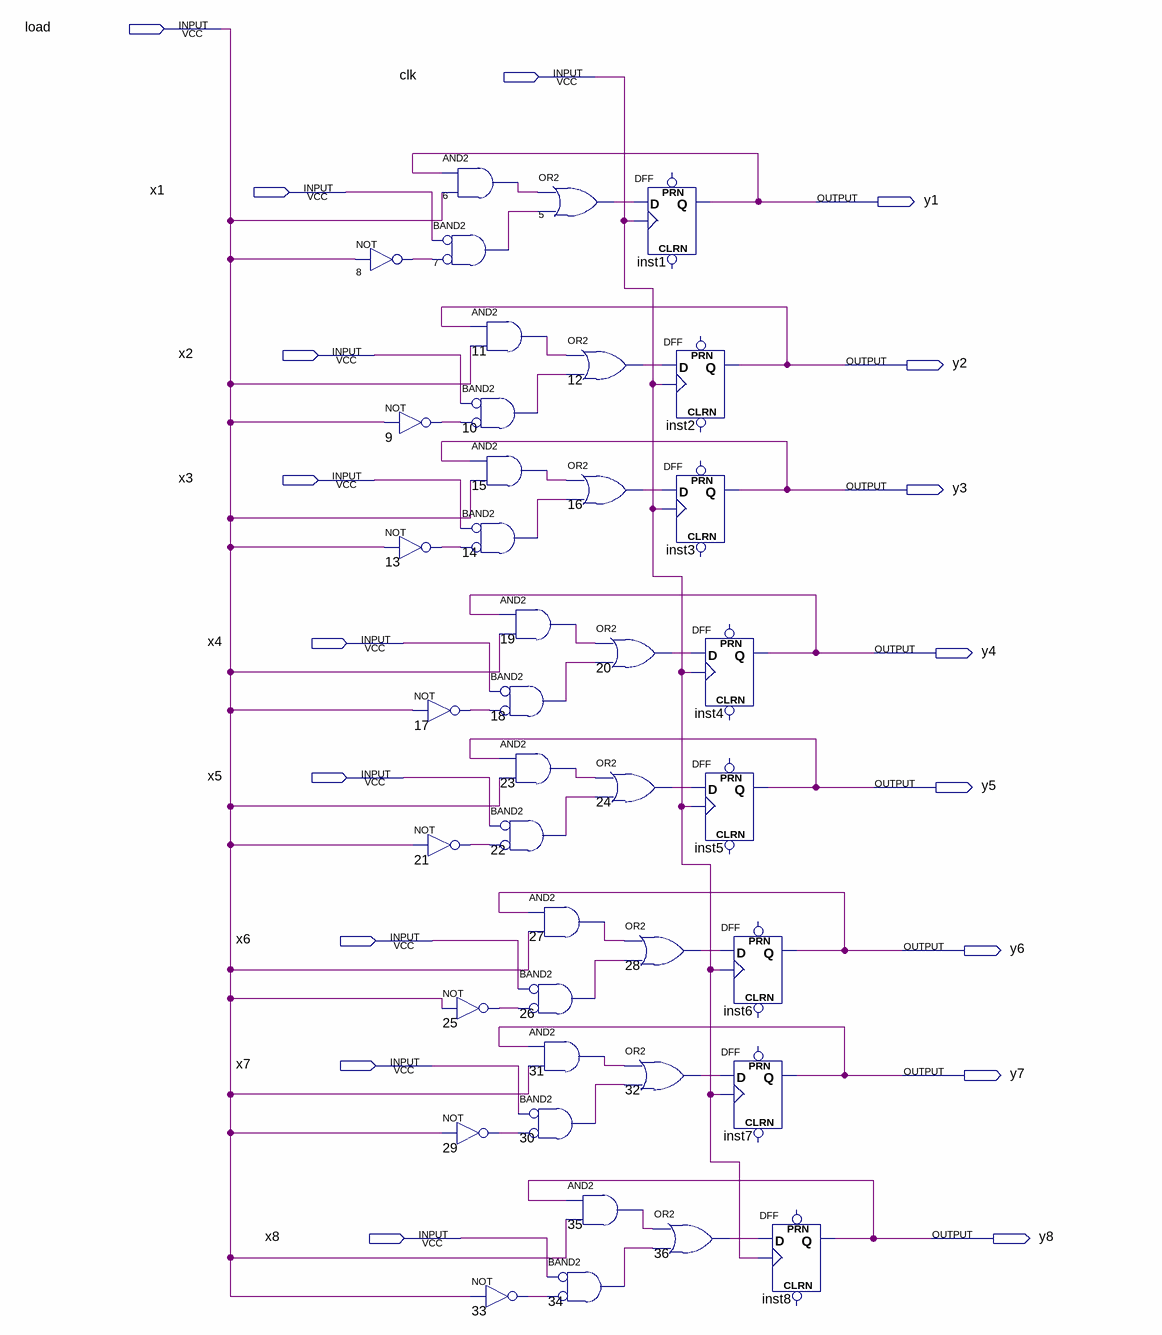
[diagram p0: schematic sheet]
// Quartus schematic lab03.bdf as structural Verilog: 40 symbols, 18 pins
module lab03 (
  input  load,
  input  clk,
  input  x1,
  input  x2,
  input  x3,
  input  x4,
  input  x5,
  input  x6,
  input  x7,
  input  x8,
  output y1,
  output y2,
  output y3,
  output y4,
  output y5,
  output y6,
  output y7,
  output y8
);

  wire n5_out, n6_out, n7_out, n8_out, n9_out, n10_out, n11_out, n12_out, n13_out, n14_out, n15_out, n16_out,
       n17_out, n18_out, n19_out, n20_out, n21_out, n22_out, n23_out, n24_out, n25_out, n26_out, n27_out,
       n28_out, n29_out, n30_out, n31_out, n32_out, n33_out, n34_out, n35_out, n36_out;

  not u_8 (n8_out, load);
  and u_6 (n6_out, y1, load);
  and u_7 (n7_out, ~x1, ~n8_out);  // BAND2
  not u_9 (n9_out, load);
  not u_13 (n13_out, load);
  not u_17 (n17_out, load);
  not u_21 (n21_out, load);
  not u_25 (n25_out, load);
  not u_29 (n29_out, load);
  and u_11 (n11_out, y2, load);
  and u_10 (n10_out, ~x2, ~n9_out);  // BAND2
  and u_15 (n15_out, y3, load);
  and u_14 (n14_out, ~x3, ~n13_out);  // BAND2
  and u_19 (n19_out, y4, load);
  and u_18 (n18_out, ~x4, ~n17_out);  // BAND2
  and u_23 (n23_out, y5, load);
  and u_22 (n22_out, ~x5, ~n21_out);  // BAND2
  and u_27 (n27_out, y6, load);
  and u_26 (n26_out, ~x6, ~n25_out);  // BAND2
  and u_31 (n31_out, y7, load);
  and u_30 (n30_out, ~x7, ~n29_out);  // BAND2
  not u_33 (n33_out, load);
  or u_5 (n5_out, n6_out, n7_out);
  or u_12 (n12_out, n11_out, n10_out);
  or u_16 (n16_out, n15_out, n14_out);
  or u_20 (n20_out, n19_out, n18_out);
  or u_24 (n24_out, n23_out, n22_out);
  and u_35 (n35_out, y8, load);
  and u_34 (n34_out, ~x8, ~n33_out);  // BAND2
  DFF inst1 (.CLK(clk), .D(n5_out), .Q(y1));  // open: CLRN, PRN
  DFF inst2 (.CLK(clk), .D(n12_out), .Q(y2));  // open: CLRN, PRN
  DFF inst3 (.CLK(clk), .D(n16_out), .Q(y3));  // open: CLRN, PRN
  or u_28 (n28_out, n27_out, n26_out);
  or u_32 (n32_out, n31_out, n30_out);
  or u_36 (n36_out, n35_out, n34_out);
  DFF inst4 (.CLK(clk), .D(n20_out), .Q(y4));  // open: CLRN, PRN
  DFF inst5 (.CLK(clk), .D(n24_out), .Q(y5));  // open: CLRN, PRN
  DFF inst6 (.CLK(clk), .D(n28_out), .Q(y6));  // open: CLRN, PRN
  DFF inst7 (.CLK(clk), .D(n32_out), .Q(y7));  // open: CLRN, PRN
  DFF inst8 (.CLK(clk), .D(n36_out), .Q(y8));  // open: CLRN, PRN
endmodule
